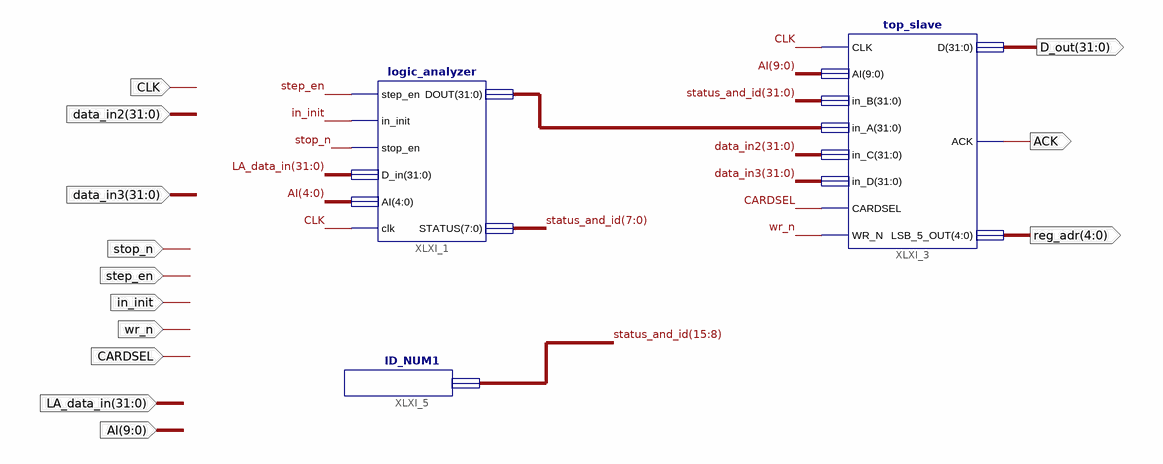
[diagram p0: schematic sheet 1]
// Xilinx ISE schematic my_monitor.sch (spartan6) as structural Verilog: 3 symbols, 13 ports
module my_monitor (
  input  CLK,
  input  stop_n,
  input  step_en,
  input  in_init,
  input  wr_n,
  input  CARDSEL,
  input  [31:0] LA_data_in,
  input  [9:0] AI,
  input  [31:0] data_in3,
  input  [31:0] data_in2,
  output [31:0] D_out,
  output ACK,
  output [4:0] reg_adr
);

  wire [31:0] status_and_id, XLXN_20;

  logic_analyzer XLXI_1 (
    .step_en(step_en), .in_init(in_init), .stop_en(stop_n), .D_in(LA_data_in), .AI(AI[4:0]), .clk(CLK),
    .DOUT(XLXN_20), .STATUS(status_and_id[7:0]));
  top_slave XLXI_3 (
    .CLK(CLK), .AI(AI), .in_B(status_and_id), .in_A(XLXN_20), .in_C(data_in2), .in_D(data_in3),
    .CARDSEL(CARDSEL), .WR_N(wr_n), .D(D_out), .ACK(ACK), .LSB_5_OUT(reg_adr));
  ID_NUM1 XLXI_5 (.ID_NUM_1(status_and_id[15:8]));
endmodule
